# Altium project MIDI_Interface.PrjPcb
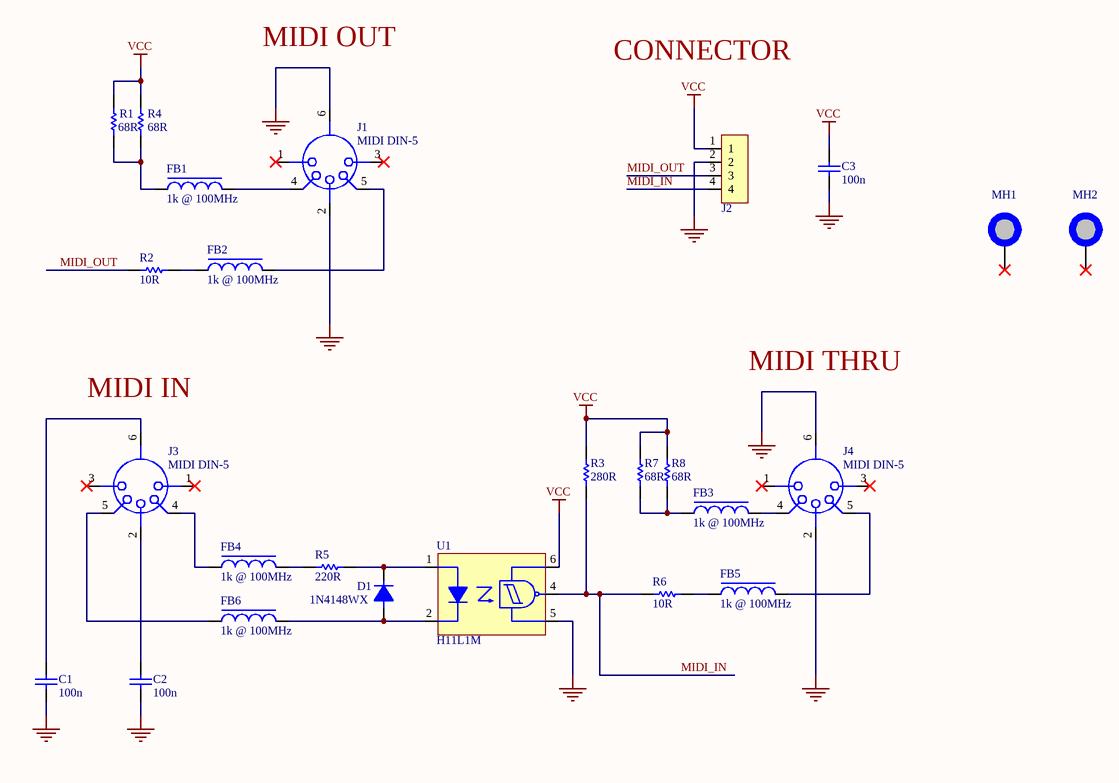
[diagram p0: MIDI_Interface.SchDoc]
1 sheet, 25 parts. Net scope: global (net labels, ports and power ports of the same name join across sheets).
Board file: MIDI_Interface.PcbDoc

## Sheet MIDI_Interface.SchDoc: MIDI Interface
size A4; DrawnBy: Laura Regan; Revision: A; SheetNumber: 1; SheetTotal: 1

### Parts
C1  100n  [C0603]
C2  100n  [C0603]
C3  100n  [C0603]
D1  1N4148WX  [SOD323]
FB1  1k @ 100MHz  [FB0603]
FB2  1k @ 100MHz  [FB0603]
FB3  1k @ 100MHz  [FB0603]
FB4  1k @ 100MHz  [FB0603]
FB5  1k @ 100MHz  [FB0603]
FB6  1k @ 100MHz  [FB0603]
J1  MIDI DIN-5  [5 PIN MIDI]
J2  HDR 1x4  [HDR M 1x4 2.54MM]  (value not drawn)
J3  MIDI DIN-5  [5 PIN MIDI]
J4  MIDI DIN-5  [5 PIN MIDI]
MH1  MH_7.4MMNC_3.2MMD  [MH_7.4MMD_3.2MMD_NON_COPPER_NPTH]  (value not drawn)  (no BOM)
MH2  MH_7.4MMNC_3.2MMD  [MH_7.4MMD_3.2MMD_NON_COPPER_NPTH]  (value not drawn)  (no BOM)
R1  68R  [R0805]
R2  10R  [R0805]
R3  280R  [R0805]
R4  68R  [R0805]
R5  220R  [R0805]
R6  10R  [R0805]
R7  68R  [R0805]
R8  68R  [R0805]
U1  H11L1M  [H11L1M]

### Nets
GND: C1.1 C2.1 C3.1 J1.2 J1.6 J2.2 J4.2 J4.6 U1.5(GND)
VCC: C3.2 J2.1 R1.2 R3.2 R4.2 R7.2 R8.2 U1.6(VCC)
MIDI_IN: J2.4 R3.1 R6.1 U1.4(Vo)
MIDI_OUT: J2.3 R2.1
NetC1_2: C1.2 J3.6
NetC2_2: C2.2 J3.2
NetD1_1: D1.1 FB6.2 U1.2(K)
NetD1_2: D1.2 R5.2 U1.1(A)
NetFB1_1: FB1.1 R1.1 R4.1
NetFB1_2: FB1.2 J1.4
NetFB2_1: FB2.1 R2.2
NetFB2_2: FB2.2 J1.5
NetFB3_1: FB3.1 R7.1 R8.1
NetFB3_2: FB3.2 J4.4
NetFB4_1: FB4.1 J3.4
NetFB4_2: FB4.2 R5.1
NetFB5_1: FB5.1 R6.2
NetFB5_2: FB5.2 J4.5
NetFB6_1: FB6.1 J3.5

Not connected (* = marked no-connect by the designer): J1 1* 3*; J3 1* 3*; J4 1* 3*; MH1 1*; MH2 1*

### Notes on the sheet
- MIDI OUT
- CONNECTOR
- (near J3) MIDI IN
- MIDI THRU

### Library data of the parts
C1-C3 = C0603KC0G100V104
FB1-FB6 = FB0603
J1 J3 J4 = MIDI DIN
J2 = HDR M 1x4 2.54MM
MH1 MH2 = MH_7.4MMNC_3.2MMD: Mounting Hole 7.4mm Diameter (Non Copper), 3.2 Drill NPTH
R1 R4 R7 R8 = R0805F68R
R2 R6 = R0805F10R
R3 = R0805F280R
R5 = R0805F220R